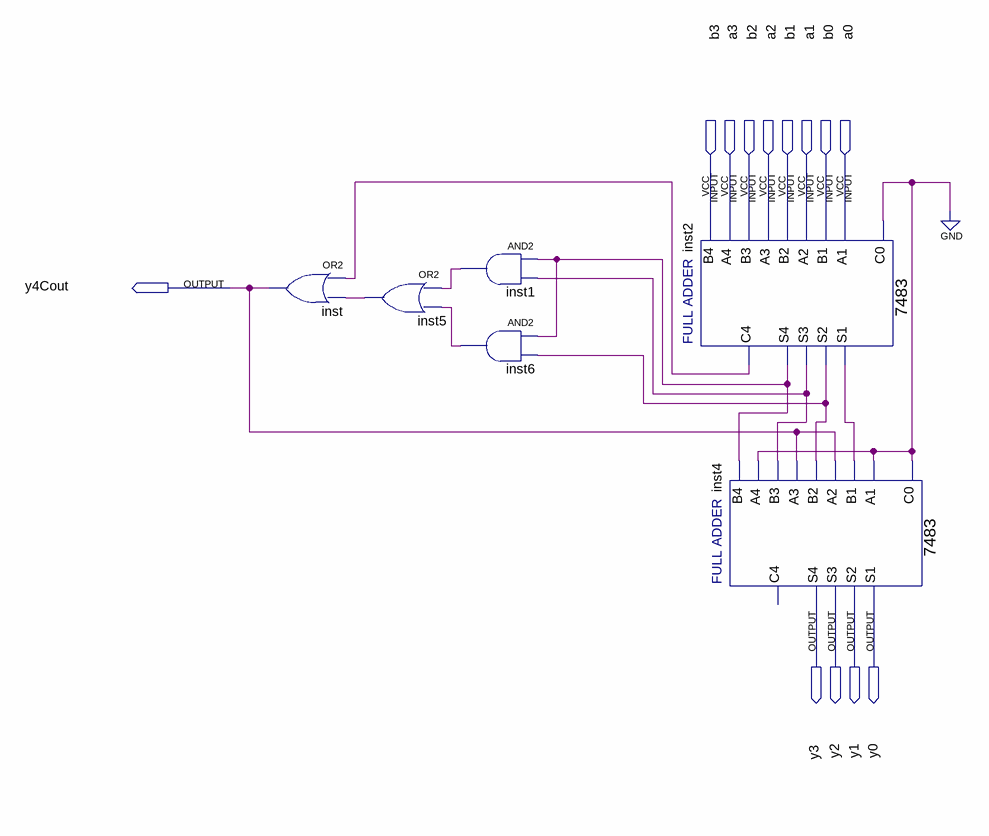
[diagram p0: schematic sheet]
// Quartus schematic bcdAdd.bdf as structural Verilog: 6 symbols, 13 pins
module bcdAdd (
  input  b3,
  input  a3,
  input  b2,
  input  a2,
  input  b1,
  input  a1,
  input  b0,
  input  a0,
  output y4Cout,
  output y3,
  output y2,
  output y1,
  output y0
);

  wire inst1_out, inst2_c4, inst2_s1, inst2_s2, inst2_s3, inst2_s4, inst5_out, inst6_out;

  or inst (y4Cout, inst2_c4, inst5_out);
  or inst5 (inst5_out, inst1_out, inst6_out);
  and inst1 (inst1_out, inst2_s4, inst2_s3);
  and inst6 (inst6_out, inst2_s4, inst2_s2);
  \7483  inst2 (
    .B4(b3), .C0(1'b0), .A1(a0), .A2(a1), .B1(b0), .B2(b1), .A3(a2), .B3(b2), .A4(a3), .S3(inst2_s3),
    .S4(inst2_s4), .S2(inst2_s2), .C4(inst2_c4), .S1(inst2_s1));
  \7483  inst4 (
    .B4(inst2_s4), .C0(1'b0), .A1(1'b0), .A2(y4Cout), .B1(inst2_s1), .B2(inst2_s2), .A3(y4Cout),
    .B3(inst2_s3), .A4(1'b0), .S3(y2), .S4(y3), .S2(y1), .S1(y0));  // open: C4
endmodule
